# Altium schematic sheet POWER SCH.SchDoc (part 2 of 3)
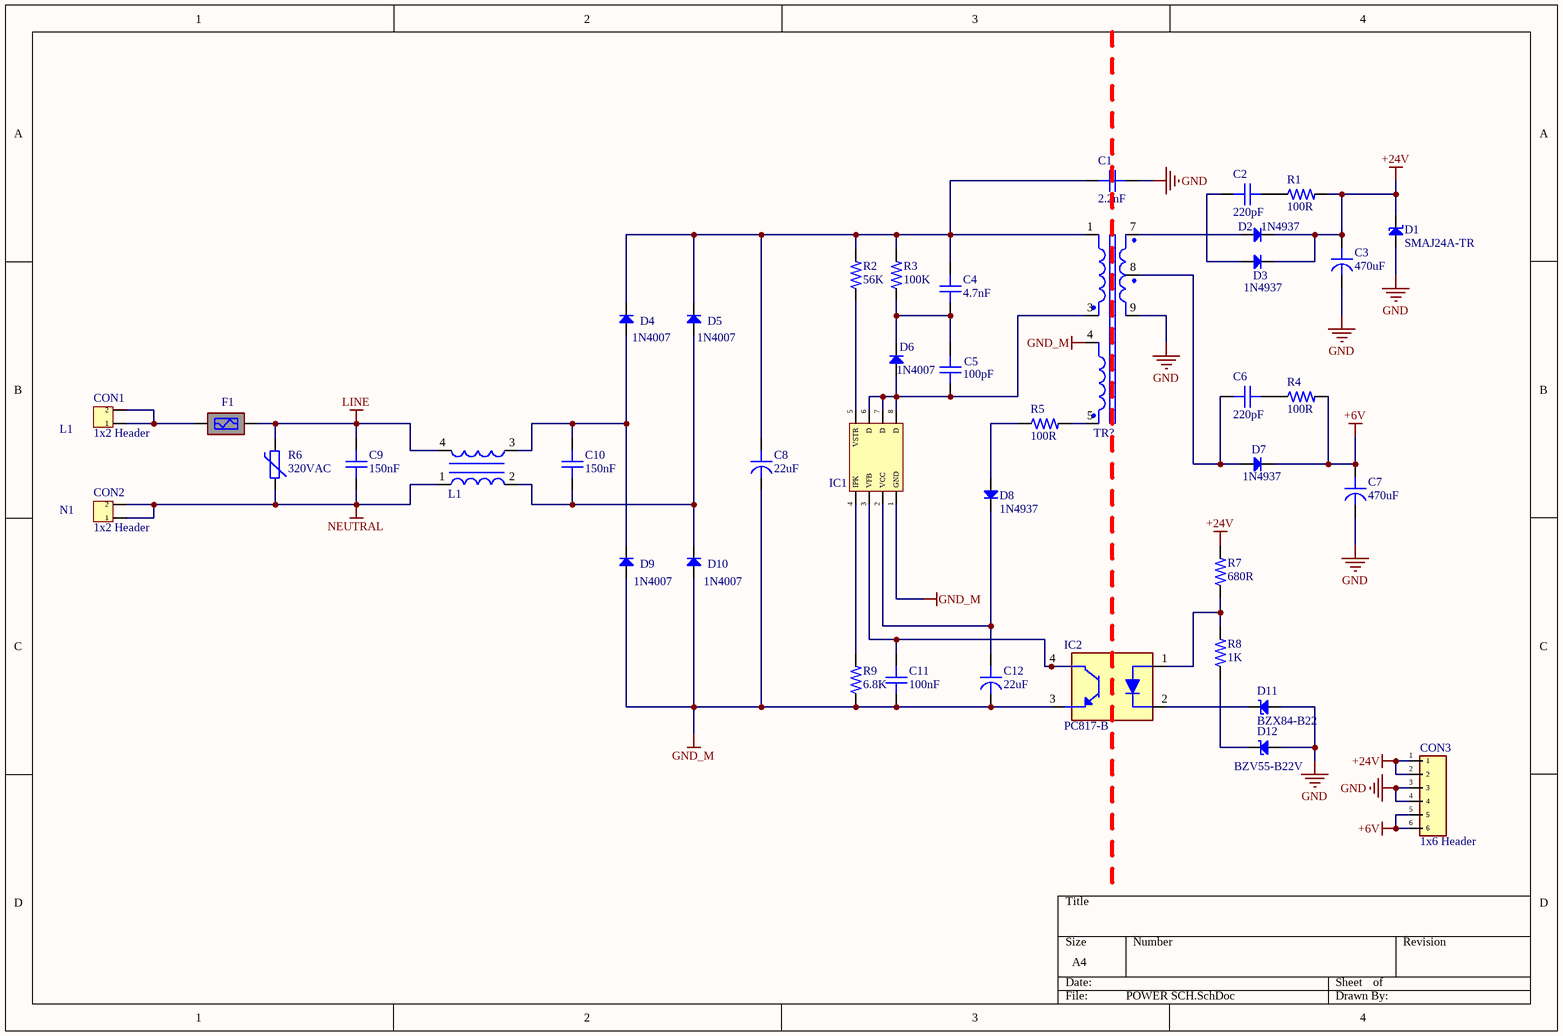
[diagram p1: POWER SCH.SchDoc]
## Library data of the parts
C1 = C0805C222KARACAUTO: KEMET - C0805C222KARACAUTO - KONDENSATOR 2200PF 250V 10% X7R 0805; Component: 1; Dielectric Material: Ceramic; Manufacturer Part Number: C0805C222KARACAUTO; Value: 2.2NF; Supplier 1: Mouser; Supplier Part Number 1: 80-C0805C222KARAUTO; Manufacturer: KEMET; RoHS: Yes; Category: Ceramic Capacitors; Stock 1: 6702; Pricing 1: 1=0,27000, 10=0,11200, 100=0,09400, 500=0,06400, 1000=0,05700, 4000=0,04500 (USD); Mount: Surface Mount; Case/Package: 0805; Min Operating Temperature: -55°C; Max Operating Temperature: 125°C; Capacitance: 2.2nF; Tolerance: 10%; Voltage Rating (DC): 250V; Dielectric: X7R; Length: 2mm; Height: 0.78mm; Depth: 1.2mm; ComponentLink1URL: http://www.farnell.com/datasheets/2571517.pdf?src-supplier=Farnell; ComponentLink1Description: http://www.farnell.com/datasheets/2571517.pdf?src-supplier=Farnell; ComponentLink2URL: https://api.kemet.com/component-edge/download/specsheet/C0805C222KARACAUTO.pdf?src-supplier=Digi-Key; ComponentLink2Description: https://api.kemet.com/component-edge/download/specsheet/C0805C222KARACAUTO.pdf?src-supplier=Digi-Key; ComponentLink3URL: https://api.kemet.com/component-edge/download/datasheet/C0805C222KARACAUTO.pdf?src-supplier=Digi-Key; ComponentLink3Description: https://api.kemet.com/component-edge/download/datasheet/C0805C222KARACAUTO.pdf?src-supplier=Digi-Key; ComponentLink4URL: http://www.farnell.com/datasheets/2571517.pdf?src-supplier=Newark; ComponentLink4Description: http://www.farnell.com/datasheets/2571517.pdf?src-supplier=Newark
C2 C6 = C0805C221KCRACTU: KEMET 220pF Multilayer Ceramic Capacitor (MLCC) 500 V dc 10% X7R dielectric C SMT max op. temp. +125C; Component: 2; Voltage Rating (DC): 500V; Dissipation Factor: 2.5%; Manufacturer Part Number: C0805C221KCRACTU; Value: 220pF; Supplier 1: Mouser; Supplier Part Number 1: 80-C0805C221KCR; Manufacturer: KEMET; RoHS: Yes; Category: Ceramic Capacitors; Stock 1: 17842; Pricing 1: 1=0,37000, 10=0,21600, 100=0,15700, 500=0,13900, 1000=0,11800, 2500=0,09500 (USD); Mount: Surface Mount,PCB; Case/Package: 0805; Dielectric Material: Ceramic; Min Operating Temperature: -55°C; Max Operating Temperature: 125°C; Capacitance: 220pF; Tolerance: 10%; Dielectric: X7R; Length: 2mm; Height: 1.25mm; Depth: 1.2mm; ComponentLink1URL: https://datasheet.ciiva.com/14606/70096142-14606492.pdf?src-supplier=Allied+Electronics; ComponentLink1Description: https://datasheet.ciiva.com/14606/70096142-14606492.pdf?src-supplier=Allied+Electronics; Number of Pins: 2; Case Code (Metric): 2012; Case Code (Imperial): 0805; Packaging: Tape and Reel; Voltage Rating: 500V; Package Quantity: 1; Termination: SMD/SMT; Voltage: 500V; Width: 0.049inch; Thickness: 0.055inch
C3 C7 = ADT-AMP1251106S4BS165A1: Cap Aluminum 470uF 35V 20% (10 X 16mm) Radial 5mm 1790mA 8000 hr 105°C Ammo Pack; Manufacturer: Adam Equipment; Component: 11; Dissipation Factor: 0.12%; Life (Hours): 8000Hour; Ripple Current: 1.79A; ESR (Equivalent Series Resistance): 28mR; Lead Diameter: 0.65mm; Lead Length: 25mm; Insulation Resistance: 10GR; Temperature Coefficient: 350ppm/°C; Manufacturer Part Number: ADT-AMP1251106S4BS165A1; Value: 470uF; Supplier 1: Digi-Key; Supplier Part Number 1: P15391CT-ND; RoHS: No; Category: Aluminum Electrolytic Capacitors; Stock 1: 492; Pricing 1: 1=0,69000, 10=0,50800, 50=0,40620, 100=0,34820 (USD); Mount: Through Hole; Case/Package: Radial; Min Operating Temperature: -40°C; Max Operating Temperature: 105°C; Capacitance: 470uF; Tolerance: 20%; Voltage Rating (DC): 35V; ComponentLink1URL: https://datasheet.ciiva.com/7718/59374-7718894.pdf?src-supplier=Element14; ComponentLink1Description: https://datasheet.ciiva.com/7718/59374-7718894.pdf?src-supplier=Element14; Number of Pins: 2; Packaging: Tape and Reel; Voltage Rating: 35V; Package Quantity: 500; Termination: Radial; Lead Pitch: 5mm; REACH SVHC: No SVHC; Impedance: 28mR
C4 = C0805C472KARACAUTO: KEMET - C0805C472KARACAUTO - Keramikvielschichtkondensator, SMD, 4700 pF, 250 V, 0805 [Metrisch 2012], ± 10%, X7R; Component: 4; Voltage Rating (DC): 250V; Manufacturer Part Number: C0805C472KARACAUTO; Value: 4.7nF; Supplier 1: Mouser; Supplier Part Number 1: 80-C0805C472KARAUTO; Manufacturer: KEMET; RoHS: Yes; Category: Capacitors; Stock 1: 3353; Pricing 1: 1=0,28000, 10=0,11500, 100=0,09700, 500=0,06700, 1000=0,05900, 4000=0,04600 (USD); Case/Package: 0805; Min Operating Temperature: -55°C; Max Operating Temperature: 125°C; Capacitance: 4.7nF; Tolerance: 10%; Dielectric: X7R; Length: 2mm; Height: 1.25mm; ComponentLink1URL: http://www.mouser.com/ds/2/212/KEM_C1023_X7R_AUTO_SMD-1093309.pdf?src-supplier=Mouser; ComponentLink1Description: http://www.mouser.com/ds/2/212/KEM_C1023_X7R_AUTO_SMD-1093309.pdf?src-supplier=Mouser; ComponentLink2URL: http://www.farnell.com/datasheets/2747493.pdf?src-supplier=Farnell; ComponentLink2Description: http://www.farnell.com/datasheets/2747493.pdf?src-supplier=Farnell; ComponentLink3URL: http://www.farnell.com/datasheets/2747493.pdf?src-supplier=Element14; ComponentLink3Description: http://www.farnell.com/datasheets/2747493.pdf?src-supplier=Element14; ComponentLink4URL: https://api.kemet.com/component-edge/download/specsheet/C0805C472KARACAUTO.pdf?src-supplier=Digi-Key; ComponentLink4Description: https://api.kemet.com/component-edge/download/specsheet/C0805C472KARACAUTO.pdf?src-supplier=Digi-Key; Case Code (Metric): 2012; Case Code (Imperial): 0805; Packaging: Tape and Reel; Voltage Rating: 250V; Package Quantity: 4000; Termination: SMD/SMT; Width: 1.2mm; ComponentLink5URL: http://www.farnell.com/datasheets/2747493.pdf?src-supplier=Newark; ComponentLink5Description: http://www.farnell.com/datasheets/2747493.pdf?src-supplier=Newark
C5 = C0805C101KDRACTU: CAP CER 100PF 1KV X7R 0805; Manufacturer: KEMET; Component: 5; Dielectric Material: Ceramic; Tolerance: 10%; Voltage Rating (DC): 1.5kV; Manufacturer Part Number: C0805C101KDRACTU; Value: 100pF; Supplier 1: Mouser; Supplier Part Number 1: 80-C0805C101KDRACTU; RoHS: Yes; Category: Ceramic Capacitors; Stock 1: 2330; Pricing 1: 1=0,52000, 10=0,31300, 100=0,18900, 500=0,16100, 1000=0,13900, 2500=0,10000 (USD); Mount: Surface Mount; Case/Package: 0805; Min Operating Temperature: -55°C; Max Operating Temperature: 125°C; Capacitance: 100pF; Dielectric: X7R; Length: 2mm; Height: 1.25mm; Depth: 1.25mm; ComponentLink1URL: http://www.farnell.com/datasheets/2315402.pdf?src-supplier=Farnell; ComponentLink1Description: http://www.farnell.com/datasheets/2315402.pdf?src-supplier=Farnell; ComponentLink2URL: http://components.arrow.com/part/dataview/0323_00070989?src-supplier=Arrow+Europe; ComponentLink2Description: http://components.arrow.com/part/dataview/0323_00070989?src-supplier=Arrow+Europe; ComponentLink3URL: http://www.mouser.com/ds/2/212/KEM_C1010_X7R_HV_SMD-1102742.pdf?src-supplier=Mouser; ComponentLink3Description: http://www.mouser.com/ds/2/212/KEM_C1010_X7R_HV_SMD-1102742.pdf?src-supplier=Mouser; ComponentLink4URL: https://search.kemet.com/component-edge/download/datasheet/C0805C101KDRACTU.pdf?src-supplier=Digi-Key; ComponentLink4Description: https://search.kemet.com/component-edge/download/datasheet/C0805C101KDRACTU.pdf?src-supplier=Digi-Key; Case Code (Metric): 2012; Case Code (Imperial): 0805; Packaging: Tape and Reel; Voltage Rating: 1kV; Package Quantity: 1; Termination: SMD/SMT; Width: 0.049inch; Thickness: 0.055inch; Radiation Hardening: No; ComponentLink5URL: https://api.kemet.com/component-edge/download/datasheet/C0805C101KDRACTU.pdf?src-supplier=Digi-Key; ComponentLink5Description: https://api.kemet.com/component-edge/download/datasheet/C0805C101KDRACTU.pdf?src-supplier=Digi-Key
C8 = PEG124YH2220QL1: Aluminum Electrolytic Capacitors - Leaded 22uF 450VDC -10% to 30%; Manufacturer: KEMET; Component: 6; Dielectric Material: Aluminium; Voltage Rating (DC): 450V; Ripple Current: 240mA; Leakage Current: 63.4uA; ESR (Equivalent Series Resistance): 2.4R; Lead Diameter: 0.8mm; Lead Length: 42mm; Manufacturer Part Number: PEG124YH2220QL1; Value: 22uF; Supplier 1: Mouser; Supplier Part Number 1: 80-PEG124YH2220QL1; RoHS: Yes; Category: Aluminum Electrolytic Capacitors; Stock 1: 959; Pricing 1: 1=5,43000, 10=4,97000, 50=4,50000, 100=4,13000, 250=3,74000, 500=3,73000 (USD); Mount: Through Hole; Case/Package: Axial; Min Operating Temperature: -40°C; Max Operating Temperature: 125°C; Capacitance: 22uF; Tolerance: 30%; Length: 29mm; ComponentLink1URL: https://www.distrelec.biz/Web/Downloads/at/_e/xwPEG124xxx_dat_e.pdf?mime=application%2Fpdf&src-supplier=Distrelec; ComponentLink1Description: https://www.distrelec.biz/Web/Downloads/at/_e/xwPEG124xxx_dat_e.pdf?mime=application%2Fpdf&src-supplier=Distrelec; ComponentLink2URL: http://components.arrow.com/part/dataview/0323_01891001?src-supplier=Arrow+Europe; ComponentLink2Description: http://components.arrow.com/part/dataview/0323_01891001?src-supplier=Arrow+Europe; ComponentLink3URL: http://www.alliedelec.com/m/d/cbb45dc6290b6e87b76194cff6cccb64.pdf?src-supplier=Allied+Electronics; ComponentLink3Description: http://www.alliedelec.com/m/d/cbb45dc6290b6e87b76194cff6cccb64.pdf?src-supplier=Allied+Electronics; ComponentLink4URL: http://www.mouser.com/ds/2/212/KEM_A4011_PEG124-1104316.pdf?src-supplier=Mouser; ComponentLink4Description: http://www.mouser.com/ds/2/212/KEM_A4011_PEG124-1104316.pdf?src-supplier=Mouser; Packaging: Bulk; Voltage Rating: 450V; Package Quantity: 150; Termination: Axial; Voltage: 450V; Diameter: 20mm; Radiation Hardening: No; ComponentLink5URL: http://uk.rs-online.com/webdocs/00ab/0900766b800abff0.pdf?src-supplier=RSComponents; ComponentLink5Description: http://uk.rs-online.com/webdocs/00ab/0900766b800abff0.pdf?src-supplier=RSComponents; ComponentLink6URL: http://capacitoredge.kemet.com/capedge2/DataSheet?pn=A142ML220Q450A&src-supplier=Avnet; ComponentLink6Description: http://capacitoredge.kemet.com/capedge2/DataSheet?pn=A142ML220Q450A&src-supplier=Avnet; ComponentLink7URL: http://capacitoredge.kemet.com/capedge2/DataSheet?pn=A142ML220Q450A&src-supplier=Avnet+Europe; ComponentLink7Description: http://capacitoredge.kemet.com/capedge2/DataSheet?pn=A142ML220Q450A&src-supplier=Avnet+Europe
C9 C10 = ECQ-UAAF154M: Cap Film 0.15uF 275VAC PP 20% (17.5 X 6 X 13mm) Radial 15mm 110C Bulk; Manufacturer: Panasonic; Component: 7; Voltage: 275V; Lead Diameter: 0.6mm; Lead/Base Style: Straight; Manufacturer Part Number: ECQ-UAAF154M; Value: 0.15uF; Supplier 1: Mouser; Supplier Part Number 1: 667-ECQ-UAAF154M; RoHS: Yes; Category: Film Capacitors; Stock 1: 1407; Pricing 1: 1=0,48000, 10=0,34000, 100=0,22400, 500=0,16600, 1000=0,14100, 2000=0,12400 (USD); Mount: Through Hole; Case/Package: Radial; Dielectric Material: PP; Min Operating Temperature: -40°C; Max Operating Temperature: 110°C; Capacitance: 150nF; Tolerance: 20%; Dielectric: PP; Length: 17.5mm; Height: 13mm; Depth: 6mm; ComponentLink1URL: https://datasheet.ciiva.com/11792/0900766b80fb6a81-11792240.pdf?src-supplier=RSComponents; ComponentLink1Description: https://datasheet.ciiva.com/11792/0900766b80fb6a81-11792240.pdf?src-supplier=RSComponents; ComponentLink2URL: https://datasheet.ciiva.com/46399/1382881-46399669.pdf?src-supplier=Element14; ComponentLink2Description: https://datasheet.ciiva.com/46399/1382881-46399669.pdf?src-supplier=Element14; ComponentLink3URL: https://datasheet.ciiva.com/17632/abd0000ce53-17632333.pdf?src-supplier=Avnet+Europe; ComponentLink3Description: https://datasheet.ciiva.com/17632/abd0000ce53-17632333.pdf?src-supplier=Avnet+Europe; ComponentLink4URL: https://datasheet.ciiva.com/30066/47abd0000ce53-30066232.pdf?src-supplier=Onlinecomponents.com; ComponentLink4Description: https://datasheet.ciiva.com/30066/47abd0000ce53-30066232.pdf?src-supplier=Onlinecomponents.com; Number of Pins: 2; Packaging: Bulk; Package Quantity: 100; Termination: Radial; Width: 0.236inch; Contact Plating: Tin; Height - Seated (Max): 0.531inch; Lead Pitch: 15mm; Radiation Hardening: No; REACH SVHC: No SVHC; Voltage Rating (AC): 275V
C11 = CGA3E2X7R1H104K080AA: TDK - CGA3E2X7R1H104K080AA. - CERAMIC CAPACITOR, 0.1UF, 50V, X7R, 0603, FULL REEL; Component: 8; Tolerance: 10%; Manufacturer Part Number: CGA3E2X7R1H104K080AA; Value: 0.1UF; Supplier 1: Mouser; Supplier Part Number 1: 810-CGA3E2X7R1H104K; Manufacturer: TDK; RoHS: Yes; Category: Ceramic Capacitors; Stock 1: 5553529; Pricing 1: 1=0,11000, 10=0,07900, 100=0,03500, 500=0,02500, 1000=0,01900, 4000=0,01300 (USD); Mount: Surface Mount; Case/Package: 0603; Min Operating Temperature: -55°C; Max Operating Temperature: 125°C; Capacitance: 100nF; Voltage Rating (DC): 50V; Dielectric: X7R; Length: 1.6mm; Height: 0.8mm; Depth: 0.8mm; ComponentLink1URL: https://datasheet.ciiva.com/24216/cga3e2x7r1h104k080aa-266291-24216208.pdf?src-supplier=Mouser; ComponentLink1Description: https://datasheet.ciiva.com/24216/cga3e2x7r1h104k080aa-266291-24216208.pdf?src-supplier=Mouser; ComponentLink2URL: https://datasheet.ciiva.com/15192/getdatasheetpartid-715867-15192412.pdf?src-supplier=Verical; ComponentLink2Description: https://datasheet.ciiva.com/15192/getdatasheetpartid-715867-15192412.pdf?src-supplier=Verical; ComponentLink3URL: https://datasheet.ciiva.com/16500/mlccspec-automotive-general-midvoltage-en-16500693.pdf?src-supplier=Future+Electronics; ComponentLink3Description: https://datasheet.ciiva.com/16500/mlccspec-automotive-general-midvoltage-en-16500693.pdf?src-supplier=Future+Electronics; ComponentLink4URL: https://datasheet.ciiva.com/22725/1735392-22725642.pdf?src-supplier=Element14; ComponentLink4Description: https://datasheet.ciiva.com/22725/1735392-22725642.pdf?src-supplier=Element14; Case Code (Metric): 1608; Case Code (Imperial): 0603; Packaging: Tape and Reel; Voltage Rating: 50V; Package Quantity: 1; Termination: SMD/SMT; Voltage: 50V; Width: 0.8mm; Thickness: 0.035inch; Radiation Hardening: No; REACH SVHC: No SVHC; Lead Free: Lead Free; ComponentLink5URL: https://datasheet.ciiva.com/23803/1936565-23803084.pdf?src-supplier=Newark; ComponentLink5Description: https://datasheet.ciiva.com/23803/1936565-23803084.pdf?src-supplier=Newark; ComponentLink6URL: https://datasheet.ciiva.com/46385/1735392-46385708.pdf?src-supplier=Element14; ComponentLink6Description: https://datasheet.ciiva.com/46385/1735392-46385708.pdf?src-supplier=Element14; Weight: 7.1E-05oz; Composition: Ceramic; Ratings: AEC-Q200
C12 = EEE-1VA220SP: CAP, ALU ELEC, 22UF, 35V, SMD; Manufacturer: Panasonic; Component: 21; Dielectric Material: Aluminium; Tolerance: 20%; Life (Hours): 2000Hour; Ripple Current: 60mA; Leakage Current: 3uA; Lead Length: 2.6mm; Manufacturer Part Number: EEE-1VA220SP; Supplier 1: Digi-Key; Supplier Part Number 1: PCE3952CT-ND; RoHS: Yes; Category: Aluminum Electrolytic Capacitors; Stock 1: 207; Pricing 1: 1=0,33000, 10=0,23000, 50=0,16100, 100=0,13790, 500=0,10346 (USD); Mount: Surface Mount,PCB; Case/Package: Radial; Min Operating Temperature: -40°C; Max Operating Temperature: 85°C; Capacitance: 22uF; Voltage Rating (DC): 35V; Length: 5.5mm; Height: 5.4mm; ComponentLink1URL: https://datasheet.ciiva.com/11778/0900766b8078636e-11778914.pdf?src-supplier=RSComponents; ComponentLink1Description: https://datasheet.ciiva.com/11778/0900766b8078636e-11778914.pdf?src-supplier=RSComponents; ComponentLink2URL: https://datasheet.ciiva.com/15166/getdatasheetpartid-135375-15166031.pdf?src-supplier=Verical; ComponentLink2Description: https://datasheet.ciiva.com/15166/getdatasheetpartid-135375-15166031.pdf?src-supplier=Verical; ComponentLink3URL: https://datasheet.ciiva.com/6085/aba0000ce2-6085109.pdf?src-supplier=Farnell; ComponentLink3Description: https://datasheet.ciiva.com/6085/aba0000ce2-6085109.pdf?src-supplier=Farnell; ComponentLink4URL: https://datasheet.ciiva.com/46376/aba0000ce2-46376415.pdf?src-supplier=Element14; ComponentLink4Description: https://datasheet.ciiva.com/46376/aba0000ce2-46376415.pdf?src-supplier=Element14; Number of Pins: 2; Packaging: Tape and Reel; Voltage Rating: 35V; Package Quantity: 1; Termination: SMD/SMT; Voltage: 35V; Width: 6.6mm; Contact Plating: Tin; Ripple Current (AC): 60mA; Diameter: 6.3mm; Height - Seated (Max): 0.213inch; Lead Pitch: 1.8mm; Radiation Hardening: No; REACH SVHC: No SVHC; Lead Free: Lead Free
CON1 CON2 = OSTOQ025450: TERM BLOCK HDR 2POS VERT 5.08MM; Manufacturer: On-Shore Technology; Component: 7; Number of Positions: 2; Manufacturer Part Number: OSTOQ025450; Supplier 1: Digi-Key; Supplier Part Number 1: ED2843-ND; RoHS: Yes; Category: Terminal Blocks; Stock 1: 6008; Pricing 1: 1=0,51000, 10=0,28000, 25=0,20880, 50=0,18620, 100=0,18250, 250=0,16060, 500=0,14600, 1000=0,13140, 5000=0,09855 (USD); Number of Pins: 2; Min Operating Temperature: -30°C; Max Operating Temperature: 105°C; Packaging: Bulk; Mount: Through Hole; Contact Plating: Tin; Termination: Solder; Color: Green
CON3 = TSW-106-07-L-S: Conn Unshrouded Header HDR 6 POS 2.54mm Solder ST Thru-Hole; Manufacturer: Samtec; Component: 5; Output Current: 125°C; Max Supply Current: 15.24mm; Tolerance: Gold; Voltage Rating: 250V; Current Rating: 2A; Current: 10A; Max DC Current: Bronze; Test Frequency: Black; Max Current Rating: Polyester; Inductance Tolerance: 1; Self Resonant Frequency: 7.6A; Min Supply Voltage: 6; Max Supply Voltage: Vertical; Number of Inputs: Male; Propagation Delay: Male Pin; Number of Elements: 0.23inch; Power Dissipation: 1.6W; Number of Positions: 2; Voltage: 300V; Pitch: 0.15inch; Insertion Loss: 1dB; Shielding: Unshielded; Body Material: Glass; Manufacturer Part Number: TSW-106-07-L-S; Supplier 1: Mouser; Supplier Part Number 1: 200-TSW10607LS; RoHS: Yes; Category: Headers and Wire Housings; Stock 1: 2038; Pricing 1: 1=0,56000, 10=0,41900, 100=0,36700, 500=0,35000, 1000=0,28800, 2500=0,25300 (USD); Min Operating Temperature: -30°C; Max Operating Temperature: -55°C; Package Quantity: 10; Packaging: Bulk; Interface: 2.54mm; Number of Channels: https://datasheet.ciiva.com/22677/82167-22677747.pdf?src-supplier=Element14; Min Dual Supply Voltage: https://datasheet.ciiva.com/22677/82167-22677747.pdf?src-supplier=Element14; Max Output Current: https://datasheet.ciiva.com/23732/320951-23732070.pdf?src-supplier=Newark; REACH SVHC: https://datasheet.ciiva.com/23732/320951-23732070.pdf?src-supplier=Newark; Halogen Free: https://datasheet.ciiva.com/25618/0900766b81154476-25618441.pdf?src-supplier=RSComponents; ComponentLink1URL: https://datasheet.ciiva.com/25618/0900766b81154476-25618441.pdf?src-supplier=RSComponents; ComponentLink1Description: https://datasheet.ciiva.com/16723/htsw-th-16723150.pdf?src-supplier=Avnet+Europe; ComponentLink2URL: https://datasheet.ciiva.com/16723/htsw-th-16723150.pdf?src-supplier=Avnet+Europe; ComponentLink3URL: https://datasheet.ciiva.com/794/ostoqxx3251-794870.pdf?src-supplier=Digi-Key; ComponentLink3Description: https://datasheet.ciiva.com/794/ostoqxx3251-794870.pdf?src-supplier=Digi-Key; ComponentLink4URL: Bulk; ComponentLink4Description: 550V; Mount: 1; Weight: Solder; Contact Plating: Tin; Termination: Solder; Voltage Rating (DC): 250V; Length: No; Height: No SVHC; Width: Lead Free; Depth: https://datasheet.ciiva.com/48561/htsw-th-48561118.pdf?src-supplier=Avnet; Radiation Hardening: https://datasheet.ciiva.com/48561/htsw-th-48561118.pdf?src-supplier=Avnet; Lead Free: https://datasheet.ciiva.com/48560/htsw-th-48560639.pdf?src-supplier=Avnet; ComponentLink5URL: https://datasheet.ciiva.com/48560/htsw-th-48560639.pdf?src-supplier=Avnet; ComponentLink6URL: https://datasheet.ciiva.com/794/ostoqxx5450-794868.pdf?src-supplier=Digi-Key; ComponentLink6Description: https://datasheet.ciiva.com/794/ostoqxx5450-794868.pdf?src-supplier=Digi-Key; ComponentLink7URL: http://www.mouser.com/ds/2/177/5c0054-77730.pdf?src-supplier=Mouser; ComponentLink7Description: http://www.mouser.com/ds/2/177/5c0054-77730.pdf?src-supplier=Mouser; Inductance: Black; Number of Terminals: 550V; Turn-On Delay Time: 6; Number of Circuits: 7.6A; Logic Function: 2.54mm; Color: Green; Number of Positions Per Level: 2; Number of Levels: 1; Orientation: Vertical; Height - Seated (Max): 49.28mm; Supplier 2: Digi-Key; Supplier Part Number 2: HM2523-ND; Stock 2: 1; Housing Material: Glass; Voltage Rating (AC): 250V
D1 = SMAJ24A-TR: STMICROELECTRONICS - SMAJ24A-TR - DIODE, TVS, 24V, 400W, UNI, SMA, RL; Component: 29; Capacitance: 600pF; Leakage Current: 200nA; Direction: Unidirectional; Clamping Voltage: 50V; Min Breakdown Voltage: 26.7V; Test Current: 1mA; Peak Pulse Current: 46A; Element Configuration: Single; Number of Elements: 1; Power Line Protection: No; Max Breakdown Voltage: 28.1V; Max Power Dissipation: 3.3W; ESD Protection: Yes; Manufacturer Part Number: SMAJ24A-TR; Supplier 1: Digi-Key; Supplier Part Number 1: 497-12777-1-ND; Manufacturer: STMicroelectronics; RoHS: Yes; Category: TVS Diodes; Stock 1: 27401; Pricing 1: 1=0,45000, 10=0,34200, 25=0,30840, 100=0,16270, 500=0,14418, 1000=0,11220, 2500=0,10266 (USD); Mount: Surface Mount; Case/Package: SMA; Min Operating Temperature: -55°C; Max Operating Temperature: 150°C; Voltage Rating (DC): 24V; Length: 4.6mm; Height: 2.03mm; ComponentLink1URL: https://datasheet.ciiva.com/15143/getdatasheetpartid-82957-15143307.pdf?src-supplier=Verical; ComponentLink1Description: https://datasheet.ciiva.com/15143/getdatasheetpartid-82957-15143307.pdf?src-supplier=Verical; ComponentLink2URL: https://datasheet.ciiva.com/7965/1724007-7965493.pdf?src-supplier=Element14; ComponentLink2Description: https://datasheet.ciiva.com/7965/1724007-7965493.pdf?src-supplier=Element14; ComponentLink3URL: https://datasheet.ciiva.com/16204/cd00001333-16204855.pdf?src-supplier=Future+Electronics; ComponentLink3Description: https://datasheet.ciiva.com/16204/cd00001333-16204855.pdf?src-supplier=Future+Electronics; ComponentLink4URL: https://datasheet.ciiva.com/46394/1724007-46394359.pdf?src-supplier=Element14; ComponentLink4Description: https://datasheet.ciiva.com/46394/1724007-46394359.pdf?src-supplier=Element14; Number of Pins: 2; Packaging: Tape and Reel; Package Quantity: 1; Termination: SMD/SMT; Composition: Zener; Lead Free: Lead Free; REACH SVHC: No SVHC; Width: 2.95mm; Radiation Hardening: No; ComponentLink5URL: https://datasheet.ciiva.com/337/cd00001333-337721.pdf?src-supplier=Digi-Key; ComponentLink5Description: https://datasheet.ciiva.com/337/cd00001333-337721.pdf?src-supplier=Digi-Key; ComponentLink6URL: https://datasheet.ciiva.com/337/cd00001333-337722.pdf?src-supplier=Digi-Key; ComponentLink6Description: https://datasheet.ciiva.com/337/cd00001333-337722.pdf?src-supplier=Digi-Key; ComponentLink7URL: https://datasheet.ciiva.com/337/cd00001333-337723.pdf?src-supplier=Digi-Key; ComponentLink7Description: https://datasheet.ciiva.com/337/cd00001333-337723.pdf?src-supplier=Digi-Key; Peak Pulse Power: 400W; Reverse Standoff Voltage: 24V; Max Reverse Leakage Current: 200nA; Reverse Breakdown Voltage: 26.7V; Operating Supply Voltage: 24V; Max Surge Current: 1mA; Breakdown Voltage: 26.7V; Number of Unidirectional Channels: 1; Power Dissipation: 400W; Polarity: Unidirectional; ComponentLink8URL: https://datasheet.ciiva.com/41443/001183973-da-01-en-transil-400w-24v-smaj24a-tr-do-214ac-stm-41443285.pdf?src-supplier=Conrad; ComponentLink8Description: https://datasheet.ciiva.com/41443/001183973-da-01-en-transil-400w-24v-smaj24a-tr-do-214ac-stm-41443285.pdf?src-supplier=Conrad
D2 D3 D7 D8 = STTH1L06A: DIODE GEN PURP 600V 1A SMA; Manufacturer: STMicroelectronics; Component: 25; Element Configuration: Single; Max Surge Current: 20A; Reverse Recovery Time: 80ns; Peak Reverse Current: 1uA; Forward Voltage: 1.3V; Max Forward Surge Current (Ifsm): 10A; Polarity: Standard; Manufacturer Part Number: STTH1L06A; Supplier 1: Digi-Key; Supplier Part Number 1: 497-3241-1-ND; RoHS: Yes; Category: Rectifier Diodes; Stock 1: 40096; Pricing 1: 1=0,38000, 10=0,30600, 25=0,27960, 100=0,17550, 500=0,16250, 1000=0,11050, 2500=0,10595 (USD); Mount: Surface Mount; Case/Package: SMA; Min Operating Temperature: -65°C; Max Operating Temperature: 175°C; Voltage Rating (DC): 600V; Length: 4.6mm; Height: 2.03mm; ComponentLink1URL: https://datasheet.ciiva.com/915/cd00002694-915858.pdf?src-supplier=Digi-Key; ComponentLink1Description: https://datasheet.ciiva.com/915/cd00002694-915858.pdf?src-supplier=Digi-Key; ComponentLink2URL: https://datasheet.ciiva.com/915/cd00002694-915859.pdf?src-supplier=Digi-Key; ComponentLink2Description: https://datasheet.ciiva.com/915/cd00002694-915859.pdf?src-supplier=Digi-Key; ComponentLink3URL: https://datasheet.ciiva.com/915/cd00002694-915860.pdf?src-supplier=Digi-Key; ComponentLink3Description: https://datasheet.ciiva.com/915/cd00002694-915860.pdf?src-supplier=Digi-Key; ComponentLink4URL: https://datasheet.ciiva.com/26818/getdatasheetpartid-65243-26818021.pdf?src-supplier=Verical; ComponentLink4Description: https://datasheet.ciiva.com/26818/getdatasheetpartid-65243-26818021.pdf?src-supplier=Verical; Number of Pins: 2; Contact Plating: Tin,Matte; Packaging: Tape and Reel; Package Quantity: 1; Lead Free: Lead Free; REACH SVHC: No SVHC; Width: 2.95mm; Radiation Hardening: No; ComponentLink5URL: https://datasheet.ciiva.com/25949/cd00002694-25949159.pdf?src-supplier=Avnet+Europe; ComponentLink5Description: https://datasheet.ciiva.com/25949/cd00002694-25949159.pdf?src-supplier=Avnet+Europe; ComponentLink6URL: https://datasheet.ciiva.com/7964/1671053-7964013.pdf?src-supplier=Element14; ComponentLink6Description: https://datasheet.ciiva.com/7964/1671053-7964013.pdf?src-supplier=Element14; ComponentLink7URL: https://datasheet.ciiva.com/7964/1671053-7964014.pdf?src-supplier=Element14; ComponentLink7Description: https://datasheet.ciiva.com/7964/1671053-7964014.pdf?src-supplier=Element14; Current Rating: 1A; Peak Non-Repetitive Surge Current: 20A; Max Repetitive Reverse Voltage (Vrrm): 600V; Recovery Time: 80ns; Average Rectified Current: 1A; Max Reverse Voltage (DC): 600V; Reverse Voltage: 600V; Forward Current: 1A; Output Current: 1A; Supplier 2: Digi-Key; Supplier Part Number 2: MMSZ5251BT1GOSCT-ND
D4-D6 = RS1M-13-F: Diode Switching 1KV 1A 2-Pin SMA T/R; Manufacturer: Diodes; Component: 30; Capacitance: 15pF; Element Configuration: Single; Max Surge Current: 30A; Reverse Recovery Time: 500ns; Peak Reverse Current: 5uA; Forward Voltage: 1.3V; Polarity: Standard; Manufacturer Part Number: RS1M-13-F; Supplier 1: Digi-Key; Supplier Part Number 1: RS1M-FDICT-ND; RoHS: Yes; Category: Rectifier Diodes; Stock 1: 175534; Pricing 1: 1=0,45000, 10=0,33900, 25=0,30560, 100=0,16110, 500=0,14276, 1000=0,11110, 2500=0,10166 (USD); Mount: Surface Mount; Case/Package: SMA; Min Operating Temperature: -65°C; Max Operating Temperature: 150°C; Voltage Rating (DC): 1kV; Length: 4.6mm; Height: 2.1mm; ComponentLink1URL: https://datasheet.ciiva.com/22695/1911854-22695829.pdf?src-supplier=Element14; ComponentLink1Description: https://datasheet.ciiva.com/22695/1911854-22695829.pdf?src-supplier=Element14; ComponentLink2URL: https://datasheet.ciiva.com/8301/ds15002-8301719.pdf?src-supplier=Avnet; ComponentLink2Description: https://datasheet.ciiva.com/8301/ds15002-8301719.pdf?src-supplier=Avnet; ComponentLink3URL: https://datasheet.ciiva.com/15144/getdatasheetpartid-102368-15144828.pdf?src-supplier=Verical; ComponentLink3Description: https://datasheet.ciiva.com/15144/getdatasheetpartid-102368-15144828.pdf?src-supplier=Verical; ComponentLink4URL: https://datasheet.ciiva.com/25946/ds15002-25946237.pdf?src-supplier=Avnet+Europe; ComponentLink4Description: https://datasheet.ciiva.com/25946/ds15002-25946237.pdf?src-supplier=Avnet+Europe; Number of Pins: 2; Packaging: Tape and Reel; Package Quantity: 5000; Lead Free: Lead Free; REACH SVHC: No SVHC; Width: 2.92mm; Radiation Hardening: No; Voltage: 1kV; Weight: 0.002258oz; Current Rating: 1A; Peak Non-Repetitive Surge Current: 30A; Max Repetitive Reverse Voltage (Vrrm): 1kV; Recovery Time: 500ns; Average Rectified Current: 1A; Max Reverse Voltage (DC): 1kV; Forward Current: 1A; Max Forward Surge Current (Ifsm): 30A; Output Current: 1A; Current: 1A; Reverse Voltage (DC): 1kV
D9 D10 = RS1M-13-F: Manufacturer: Diodes; Component: 30; Capacitance: 15pF; Voltage Rating (DC): 1kV; Current Rating: 1A; Element Configuration: Single; Max Surge Current: 30A; Reverse Recovery Time: 500ns; Peak Reverse Current: 5uA; Forward Voltage: 1.3V; Polarity: Standard; Manufacturer Part Number: RS1M-13-F; Supplier 1: Digi-Key; Supplier Part Number 1: RS1M-FDICT-ND; RoHS: Yes; Category: Rectifier Diodes; Stock 1: 175534; Pricing 1: 1=0,45000, 10=0,33900, 25=0,30560, 100=0,16110, 500=0,14276, 1000=0,11110, 2500=0,10166 (USD); Mount: Surface Mount; Case/Package: SMA; Min Operating Temperature: -65°C; Max Operating Temperature: 150°C; Length: 4.6mm; Height: 2.1mm; ComponentLink1URL: https://datasheet.ciiva.com/22695/1911854-22695829.pdf?src-supplier=Element14; ComponentLink1Description: https://datasheet.ciiva.com/22695/1911854-22695829.pdf?src-supplier=Element14; ComponentLink2URL: https://datasheet.ciiva.com/8301/ds15002-8301719.pdf?src-supplier=Avnet; ComponentLink2Description: https://datasheet.ciiva.com/8301/ds15002-8301719.pdf?src-supplier=Avnet; ComponentLink3URL: https://datasheet.ciiva.com/15144/getdatasheetpartid-102368-15144828.pdf?src-supplier=Verical; ComponentLink3Description: https://datasheet.ciiva.com/15144/getdatasheetpartid-102368-15144828.pdf?src-supplier=Verical; ComponentLink4URL: https://datasheet.ciiva.com/25946/ds15002-25946237.pdf?src-supplier=Avnet+Europe; ComponentLink4Description: https://datasheet.ciiva.com/25946/ds15002-25946237.pdf?src-supplier=Avnet+Europe; Number of Pins: 2; Packaging: Tape and Reel; Package Quantity: 5000; Lead Free: Lead Free; REACH SVHC: No SVHC; Width: 2.92mm; Radiation Hardening: No; Voltage: 1kV; Weight: 0.002258oz; Peak Non-Repetitive Surge Current: 30A; Max Repetitive Reverse Voltage (Vrrm): 1kV; Recovery Time: 500ns; Average Rectified Current: 1A; Max Reverse Voltage (DC): 1kV; Forward Current: 1A; Max Forward Surge Current (Ifsm): 30A; Output Current: 1A; Current: 1A; Reverse Voltage (DC): 1kV
D11 = BZX84C22LT1G: DIODE ZENER 22V 225MW SOT23-3; Manufacturer: ON Semiconductor; Component: 27; Tolerance: 6%; Max Reverse Leakage Current: 50nA; Test Current: 5mA; Element Configuration: Single; Power Dissipation: 300mW; ESD Protection: Yes; Forward Voltage: 900mV; Forward Current: 10mA; Impedance: 55R; Manufacturer Part Number: BZX84C22LT1G; Supplier 1: Digi-Key; Supplier Part Number 1: BZX84C22LT1GOSCT-ND; RoHS: Yes; Category: Zener Diodes; Stock 1: 46073; Pricing 1: 1=0,14000, 10=0,12300, 25=0,11760, 100=0,05170, 500=0,04060, 1000=0,02820 (USD); Case/Package: SOT-23-3; Min Operating Temperature: -65°C; Max Operating Temperature: 150°C; Voltage Rating (DC): 22V; Length: 3.04mm; Height: 1.01mm; ComponentLink1URL: https://datasheet.ciiva.com/30478/0900766b8121b438-30478464.pdf?src-supplier=RSComponents; ComponentLink1Description: https://datasheet.ciiva.com/30478/0900766b8121b438-30478464.pdf?src-supplier=RSComponents; ComponentLink2URL: https://datasheet.ciiva.com/15142/getdatasheetpartid-53776-15142130.pdf?src-supplier=Verical; ComponentLink2Description: https://datasheet.ciiva.com/15142/getdatasheetpartid-53776-15142130.pdf?src-supplier=Verical; ComponentLink3URL: https://datasheet.ciiva.com/894/bzx84c2v4lt1-d-894848.pdf?src-supplier=Digi-Key; ComponentLink3Description: https://datasheet.ciiva.com/894/bzx84c2v4lt1-d-894848.pdf?src-supplier=Digi-Key; ComponentLink4URL: https://datasheet.ciiva.com/894/bzx84c2v4lt1-d-894849.pdf?src-supplier=Digi-Key; ComponentLink4Description: https://datasheet.ciiva.com/894/bzx84c2v4lt1-d-894849.pdf?src-supplier=Digi-Key; Number of Pins: 3; Contact Plating: Tin,Matte; Packaging: Tape and Reel; Package Quantity: 3000; Lead Free: Lead Free; REACH SVHC: No SVHC; Width: 1.4mm; Radiation Hardening: No; ComponentLink5URL: https://datasheet.ciiva.com/894/bzx84c2v4lt1-d-894850.pdf?src-supplier=Digi-Key; ComponentLink5Description: https://datasheet.ciiva.com/894/bzx84c2v4lt1-d-894850.pdf?src-supplier=Digi-Key; ComponentLink6URL: https://datasheet.ciiva.com/25928/bzx84c2v4lt1-d-25928650.pdf?src-supplier=Avnet+Europe; ComponentLink6Description: https://datasheet.ciiva.com/25928/bzx84c2v4lt1-d-25928650.pdf?src-supplier=Avnet+Europe; ComponentLink7URL: https://datasheet.ciiva.com/10637/bzx84c2v4lt1-d-10637787.pdf?src-supplier=Avnet; ComponentLink7Description: https://datasheet.ciiva.com/10637/bzx84c2v4lt1-d-10637787.pdf?src-supplier=Avnet; Max Power Dissipation: 225mW; Peak Reverse Current: 50nA; Halogen Free: Halogen Free; Zener Voltage: 22V; Voltage Tolerance: 6%; Zener Current: 10mA; Power Rating: 225mW; Working Voltage: 22V
D12 = MMSZ22T1G: Zener Diodes 22V 500mW; Manufacturer: ON Semiconductor; Component: 28; Tolerance: 5%; Max Reverse Leakage Current: 50nA; Test Current: 5mA; Element Configuration: Single; Forward Voltage: 900mV; Impedance: 55R; Zener Current: 10mA; Manufacturer Part Number: MMSZ22T1G; Supplier 1: Digi-Key; Supplier Part Number 1: MMSZ22T1GOSCT-ND; RoHS: Yes; Category: Zener Diodes; Stock 1: 35139; Pricing 1: 1=0,21000, 10=0,19300, 25=0,18360, 100=0,08090, 500=0,06350, 1000=0,04410 (USD); Case/Package: SOD-123-2; Min Operating Temperature: -55°C; Max Operating Temperature: 150°C; Voltage Rating (DC): 22V; Length: 2.84mm; Height: 1.25mm; ComponentLink1URL: https://datasheet.ciiva.com/25926/mmsz2v4t1-d-25926218.pdf?src-supplier=Avnet+Europe; ComponentLink1Description: https://datasheet.ciiva.com/25926/mmsz2v4t1-d-25926218.pdf?src-supplier=Avnet+Europe; ComponentLink2URL: https://datasheet.ciiva.com/6388/mmsz2v4t1-d-6388831.pdf?src-supplier=Digi-Key; ComponentLink2Description: https://datasheet.ciiva.com/6388/mmsz2v4t1-d-6388831.pdf?src-supplier=Digi-Key; Number of Pins: 2; Packaging: Tape and Reel; Package Quantity: 3000; Lead Free: Lead Free; Width: 1.8mm; Radiation Hardening: No; Power Dissipation: 500mW; Max Power Dissipation: 500mW; Peak Reverse Current: 50nA; Zener Voltage: 22V; Voltage Tolerance: 5%; Power Rating: 500mW; Working Voltage: 22V
F1 = 0034.3120: SCHURTER - 0034.3120 - Fuse, Cartridge, Time Delay, 2 A, 250 V, 5mm x 20mm, 0.2" x 0.79", FST Series; Component: 9; Manufacturer Part Number: 0034.3120; Supplier 1: Digi-Key; Supplier Part Number 1: 486-1219-ND; Manufacturer: Schurter; RoHS: Yes; Category: Fuses; Stock 1: 9179; Pricing 1: 1=0,44000, 50=0,36400, 100=0,27800, 500=0,21300, 1000=0,19440 (USD); Number of Pins: 2; Mount: Holder,Surface Mount,Clip; Weight: 0.033158oz
IC1 = TLE8102SG: IC SWITCH LOSIDE 2CH DSO-12; Manufacturer: Infineon; Component: 1; Output Current: 5A; Number of Outputs: 2; Nominal Supply Current: 5mA; On-State Resistance: 180mR; Interface: Serial; Min Dual Supply Voltage: 48V; Max Output Current: 6.5A; Manufacturer Part Number: TLE8102SG; Supplier 1: Mouser; Supplier Part Number 1: 726-TLE8102SG; RoHS: Yes; Category: Hot Swap Controllers; Stock 1: 4211; Pricing 1: 1=5,69000, 10=4,84000, 100=4,19000, 250=3,98000, 500=3,57000, 1000=3,01000 (USD); Case/Package: SOIC; Number of Pins: 12; Min Operating Temperature: -40°C; Max Operating Temperature: 150°C; Package Quantity: 1; Packaging: Tape and Reel; Max Supply Current: 5mA; Number of Channels: 2; REACH SVHC: No SVHC; Halogen Free: Halogen Free; ComponentLink1URL: https://datasheet.ciiva.com/41458/001183484-da-01-en-ic-switch-loside-2c-tle8102sg-dso-12-inf-41458732.pdf?src-supplier=Conrad; ComponentLink1Description: https://datasheet.ciiva.com/41458/001183484-da-01-en-ic-switch-loside-2c-tle8102sg-dso-12-inf-41458732.pdf?src-supplier=Conrad; ComponentLink2URL: https://datasheet.ciiva.com/1955/infineon-tle8102sg-ds-v01-05-en-1955985.pdf?src-supplier=Digi-Key; ComponentLink2Description: https://datasheet.ciiva.com/1955/infineon-tle8102sg-ds-v01-05-en-1955985.pdf?src-supplier=Digi-Key; ComponentLink3URL: https://datasheet.ciiva.com/1955/infineon-tle8102sg-ds-v01-05-en-1955986.pdf?src-supplier=Digi-Key; ComponentLink3Description: https://datasheet.ciiva.com/1955/infineon-tle8102sg-ds-v01-05-en-1955986.pdf?src-supplier=Digi-Key; ComponentLink4URL: https://datasheet.ciiva.com/1955/infineon-tle8102sg-ds-v01-05-en-1955987.pdf?src-supplier=Digi-Key; ComponentLink4Description: https://datasheet.ciiva.com/1955/infineon-tle8102sg-ds-v01-05-en-1955987.pdf?src-supplier=Digi-Key
IC2 = NC7WZ132K8X: IC,NC7WZ132K8X,; Manufacturer: ON Semiconductor / Fairchild; Component: 4; Output Current: 32mA; Number of Outputs: 1; Min Supply Voltage: 1.65V; Max Supply Voltage: 5.5V; Number of Inputs: 2; Turn-On Delay Time: 6.3ns; Propagation Delay: 13ns; Logic Function: NAND; Quiescent Current: 1uA; High Level Output Current: -32mA; Schmitt Trigger Input: No; Manufacturer Part Number: NC7WZ132K8X; Supplier 1: Mouser; Supplier Part Number 1: 512-NC7WZ132K8X; RoHS: Yes; Category: Logic Gates; Stock 1: 3369; Pricing 1: 1=0,46000, 10=0,33900, 100=0,18900, 1000=0,14200, 3000=0,12200, 9000=0,11400 (USD); Number of Pins: 8; Min Operating Temperature: -40°C; Max Operating Temperature: 85°C; Package Quantity: 3000; Packaging: Tape and Reel; REACH SVHC: No SVHC; ComponentLink1URL: https://datasheet.ciiva.com/4818/nc7wz132-97672-4818801.pdf?src-supplier=Mouser; ComponentLink1Description: https://datasheet.ciiva.com/4818/nc7wz132-97672-4818801.pdf?src-supplier=Mouser; ComponentLink2URL: https://datasheet.ciiva.com/8278/nc7wz132-8278945.pdf?src-supplier=Avnet; ComponentLink2Description: https://datasheet.ciiva.com/8278/nc7wz132-8278945.pdf?src-supplier=Avnet; ComponentLink3URL: https://datasheet.ciiva.com/15090/getdatasheetpartid-110777-15090731.pdf?src-supplier=Verical; ComponentLink3Description: https://datasheet.ciiva.com/15090/getdatasheetpartid-110777-15090731.pdf?src-supplier=Verical; ComponentLink4URL: https://datasheet.ciiva.com/34301/1027871-34301887.pdf?src-supplier=Jameco; ComponentLink4Description: https://datasheet.ciiva.com/34301/1027871-34301887.pdf?src-supplier=Jameco; Mount: Surface Mount; Weight: 0.03g; Contact Plating: Tin,Matte; Length: 2.3mm; Height: 0.7mm; Width: 2mm; Radiation Hardening: No; Lead Free: Lead Free; ComponentLink5URL: https://datasheet.ciiva.com/26865/nc7wz132k8x-26865071.pdf?src-supplier=IIIC; ComponentLink5Description: https://datasheet.ciiva.com/26865/nc7wz132k8x-26865071.pdf?src-supplier=IIIC; ComponentLink6URL: https://datasheet.ciiva.com/1868/nc7wz132-1868154.pdf?src-supplier=Digi-Key; ComponentLink6Description: https://datasheet.ciiva.com/1868/nc7wz132-1868154.pdf?src-supplier=Digi-Key; ComponentLink7URL: https://datasheet.ciiva.com/1868/nc7wz132-1868155.pdf?src-supplier=Digi-Key; ComponentLink7Description: https://datasheet.ciiva.com/1868/nc7wz132-1868155.pdf?src-supplier=Digi-Key; ComponentLink8URL: https://datasheet.ciiva.com/1868/nc7wz132-1868156.pdf?src-supplier=Digi-Key; ComponentLink8Description: https://datasheet.ciiva.com/1868/nc7wz132-1868156.pdf?src-supplier=Digi-Key; Number of Terminals: 8; Number of Circuits: 2; Number of Elements: 2; Low Level Output Current: 32mA; Number of Gates: 2
L1 = 744272392: WURTH ELEKTRONIK - 744272392 - Filter, Netzfilter, Oberflächenmontage, 2X3900µH, WE-SL5, 9.6 kOhm, 520mA, 10mm x 8.7mm x 6.5mm; Manufacturer: Wurth Electronics; Component: 3; Resistance: 540mR; Tolerance: 40%; Voltage Rating: 80V; Core Material: Ferrite; Impedance: 9.6kR; Number of Lines: 2; Test Frequency: 100kHz; Inductance: 3.9mH; Manufacturer Part Number: 744272392; Value: 2X3900µH; Supplier 1: Mouser; Supplier Part Number 1: 710-744272392; RoHS: Yes; Category: Common Mode Chokes; Stock 1: 1253; Pricing 1: 1=3,14000, 10=2,91000, 25=2,91000, 50=2,63000, 100=2,54000, 250=2,54000 (USD); Case/Package: SMD/SMT; Number of Pins: 4; Min Operating Temperature: -40°C; Max Operating Temperature: 125°C; Package Quantity: 1; Packaging: Tape and Reel; REACH SVHC: No SVHC; ComponentLink1URL: https://datasheet.ciiva.com/7764/1735670-7764962.pdf?src-supplier=Element14; ComponentLink1Description: https://datasheet.ciiva.com/7764/1735670-7764962.pdf?src-supplier=Element14; ComponentLink2URL: https://datasheet.ciiva.com/7265/744272392-7265012.pdf?src-supplier=Newark; ComponentLink2Description: https://datasheet.ciiva.com/7265/744272392-7265012.pdf?src-supplier=Newark; ComponentLink3URL: https://datasheet.ciiva.com/6048/1696178-6048502.pdf?src-supplier=Farnell; ComponentLink3Description: https://datasheet.ciiva.com/6048/1696178-6048502.pdf?src-supplier=Farnell; ComponentLink4URL: https://datasheet.ciiva.com/17069/0900766b80596bb6-17069704.pdf?src-supplier=Allied+Electronics; ComponentLink4Description: https://datasheet.ciiva.com/17069/0900766b80596bb6-17069704.pdf?src-supplier=Allied+Electronics; Mount: Surface Mount; Weight: 0.026103oz; Termination: SMD/SMT; Voltage Rating (DC): 80V; Length: 0.394inch; Height: 6.5mm; Width: 0.343inch; Depth: 8.7mm; Lead Free: Lead Free; ComponentLink5URL: https://datasheet.ciiva.com/4952/744272392-25143-4952443.pdf?src-supplier=Mouser; ComponentLink5Description: https://datasheet.ciiva.com/4952/744272392-25143-4952443.pdf?src-supplier=Mouser; ComponentLink6URL: https://datasheet.ciiva.com/6216/744272392-6216197.pdf?src-supplier=Digi-Key; ComponentLink6Description: https://datasheet.ciiva.com/6216/744272392-6216197.pdf?src-supplier=Digi-Key; ComponentLink7URL: https://datasheet.ciiva.com/6216/744272392-6216199.pdf?src-supplier=Digi-Key; ComponentLink7Description: https://datasheet.ciiva.com/6216/744272392-6216199.pdf?src-supplier=Digi-Key; ComponentLink8URL: https://datasheet.ciiva.com/26308/744272392-eng-tds-26308748.pdf?src-supplier=Distrelec; ComponentLink8Description: https://datasheet.ciiva.com/26308/744272392-eng-tds-26308748.pdf?src-supplier=Distrelec; Current Rating: 520mA; Current: 520mA; DC Resistance (DCR): 540mR; Max DC Current: 520mA; Max Current Rating: 520mA; Inductance Tolerance: 40%; Self Resonant Frequency: 100kHz
R1 R4 R5 = CRCW1206100RJNEA (2): Res Thick Film 1206 100 Ohm 5% 1/4W 200ppm/C Molded SMD SMD Paper T/R; Manufacturer: Vishay Dale; Component: 10; Temperature Coefficient: 200ppm/°C; Power Rating: 250mW; Voltage Rating: 200V; Manufacturer Part Number: CRCW1206100RJNEA (2); Supplier 1: Digi-Key; Supplier Part Number 1: 541-100ECT-ND; RoHS: Yes; Category: Chip SMD Resistors; Stock 1: 1332; Pricing 1: 1=0,10000, 10=0,07000, 100=0,02840, 1000=0,01275, 2500=0,01106 (USD); Mount: Surface Mount; Case/Package: 1206; Weight: 0.000353oz; Case Code (Imperial): 1206; Case Code (Metric): 3216; Contact Plating: Tin; Min Operating Temperature: -55°C; Max Operating Temperature: 155°C; Resistance: 100R; Tolerance: 5%; Packaging: Tape and Reel; Composition: Thick Film; Termination: SMD/SMT; Package Quantity: 5000; Military Standard: Not; Length: 3.2mm; Height: 0.55mm; Width: 1.6mm; Depth: 1.6mm; Radiation Hardening: No; REACH SVHC: Unknown; ComponentLink1URL: https://datasheet.ciiva.com/16755/70201119-16755637.pdf?src-supplier=Allied+Electronics; ComponentLink1Description: https://datasheet.ciiva.com/16755/70201119-16755637.pdf?src-supplier=Allied+Electronics; ComponentLink2URL: https://datasheet.ciiva.com/5547/dcrcwe3-109170-5547382.pdf?src-supplier=Mouser; ComponentLink2Description: https://datasheet.ciiva.com/5547/dcrcwe3-109170-5547382.pdf?src-supplier=Mouser; ComponentLink3URL: https://datasheet.ciiva.com/8979/dcrcwe3-8979850.pdf?src-supplier=Avnet; ComponentLink3Description: https://datasheet.ciiva.com/8979/dcrcwe3-8979850.pdf?src-supplier=Avnet; ComponentLink4URL: https://datasheet.ciiva.com/28621/1847332-28621482.pdf?src-supplier=Element14; ComponentLink4Description: https://datasheet.ciiva.com/28621/1847332-28621482.pdf?src-supplier=Element14; ComponentLink5URL: https://datasheet.ciiva.com/8979/dcrcwe3-8979852.pdf?src-supplier=Avnet; ComponentLink5Description: https://datasheet.ciiva.com/8979/dcrcwe3-8979852.pdf?src-supplier=Avnet; ComponentLink6URL: https://datasheet.ciiva.com/16759/70201119-16759884.pdf?src-supplier=Allied+Electronics; ComponentLink6Description: https://datasheet.ciiva.com/16759/70201119-16759884.pdf?src-supplier=Allied+Electronics; ComponentLink7URL: https://datasheet.ciiva.com/17171/dcrcwe3-17171503.pdf?src-supplier=Avnet+Europe; ComponentLink7Description: https://datasheet.ciiva.com/17171/dcrcwe3-17171503.pdf?src-supplier=Avnet+Europe
R2 = CRCW120656K0JNEA: Resistor,Metal Glaze,56KOhms,200WV,5+/-% Tol,-200,200ppm-TC,1206-Case ;RoHS Compliant: Yes; Manufacturer: Vishay Dale; Component: 11; Resistance: 56kR; Tolerance: 5%; Temperature Coefficient: 200ppm/°C; Max Power Dissipation: 250mW; Voltage Rating: 200V; Manufacturer Part Number: CRCW120656K0JNEA; Supplier 1: Digi-Key; Supplier Part Number 1: 541-56KECT-ND; RoHS: Yes; Category: Chip SMD Resistors; Stock 1: 3044; Pricing 1: 1=0,10000, 10=0,07000, 100=0,02840, 1000=0,01275, 2500=0,01106 (USD); Case/Package: 1206; Number of Pins: 2; Weight: 0.000353oz; Case Code (Imperial): 1206; Case Code (Metric): 3216; Contact Plating: Tin; Min Operating Temperature: -55°C; Max Operating Temperature: 155°C; Packaging: Tape and Reel; Composition: Thick Film; Number of Terminations: 2; Features: Automotive AEC-Q200; Power Rating: 250mW; Package Quantity: 5000; Voltage Rating (DC): 200V; Military Standard: Not; Length: 3.2mm; Height: 0.55mm; Width: 0.063inch; Depth: 1.6mm; Radiation Hardening: No; Lead Free: Lead Free; REACH SVHC: Unknown; ComponentLink1URL: https://datasheet.ciiva.com/2496/dcrcwe3-2496448.pdf?src-supplier=Digi-Key; ComponentLink1Description: https://datasheet.ciiva.com/2496/dcrcwe3-2496448.pdf?src-supplier=Digi-Key; ComponentLink2URL: https://datasheet.ciiva.com/2496/dcrcwe3-2496449.pdf?src-supplier=Digi-Key; ComponentLink2Description: https://datasheet.ciiva.com/2496/dcrcwe3-2496449.pdf?src-supplier=Digi-Key; ComponentLink3URL: https://datasheet.ciiva.com/2496/dcrcwe3-2496450.pdf?src-supplier=Digi-Key; ComponentLink3Description: https://datasheet.ciiva.com/2496/dcrcwe3-2496450.pdf?src-supplier=Digi-Key; ComponentLink4URL: https://datasheet.ciiva.com/8999/dcrcwe3-8999045.pdf?src-supplier=Avnet; ComponentLink4Description: https://datasheet.ciiva.com/8999/dcrcwe3-8999045.pdf?src-supplier=Avnet; ComponentLink5URL: https://datasheet.ciiva.com/8999/dcrcwe3-8999051.pdf?src-supplier=Avnet; ComponentLink5Description: https://datasheet.ciiva.com/8999/dcrcwe3-8999051.pdf?src-supplier=Avnet; Working Voltage: 200V; Height - Seated (Max): 0.024inch
R3 = ERJ-1TYJ104U: RES SMD 100K OHM 5% 1W 2512; Manufacturer: Panasonic; Component: 12; Resistance: 100kR; Temperature Coefficient: 200ppm/°C; Voltage Rating: 200V; Voltage Rating (DC): 250V; Manufacturer Part Number: ERJ-1TYJ104U; Supplier 1: Digi-Key; Supplier Part Number 1: PT100KXCT-ND; RoHS: Yes; Category: Chip SMD Resistors; Stock 1: 14258; Pricing 1: 1=0,39000, 10=0,30100, 100=0,12660, 1000=0,06987 (USD); Mount: Surface Mount; Case/Package: 2512; Case Code (Imperial): 2512; Case Code (Metric): 6432; Contact Plating: Tin; Min Operating Temperature: -55°C; Max Operating Temperature: 155°C; Tolerance: 5%; Packaging: Tape and Reel; Composition: Thick Film; Max Power Dissipation: 1W; Number of Terminations: 2; Power Rating: 1W; Package Quantity: 1; Military Standard: Not; Length: 6.4mm; Height: 0.028inch; Width: 0.126inch; Depth: 3.2mm; Radiation Hardening: No; Lead Free: Lead Free; REACH SVHC: No SVHC; ComponentLink1URL: https://datasheet.ciiva.com/34303/2010000-34303803.pdf?src-supplier=Jameco; ComponentLink1Description: https://datasheet.ciiva.com/34303/2010000-34303803.pdf?src-supplier=Jameco; ComponentLink2URL: https://datasheet.ciiva.com/43469/1678796-43469942.pdf?src-supplier=Farnell; ComponentLink2Description: https://datasheet.ciiva.com/43469/1678796-43469942.pdf?src-supplier=Farnell; ComponentLink3URL: https://datasheet.ciiva.com/7830/1678796-7830968.pdf?src-supplier=Element14; ComponentLink3Description: https://datasheet.ciiva.com/7830/1678796-7830968.pdf?src-supplier=Element14; ComponentLink4URL: https://datasheet.ciiva.com/46380/1678796-46380426.pdf?src-supplier=Element14; ComponentLink4Description: https://datasheet.ciiva.com/46380/1678796-46380426.pdf?src-supplier=Element14; ComponentLink5URL: https://datasheet.ciiva.com/30120/4aoa0000ce1-30120107.pdf?src-supplier=Onlinecomponents.com; ComponentLink5Description: https://datasheet.ciiva.com/30120/4aoa0000ce1-30120107.pdf?src-supplier=Onlinecomponents.com; ComponentLink6URL: https://datasheet.ciiva.com/17208/aoa0000ce1-17208142.pdf?src-supplier=Avnet+Europe; ComponentLink6Description: https://datasheet.ciiva.com/17208/aoa0000ce1-17208142.pdf?src-supplier=Avnet+Europe
R6 = B72220Q0321K101: EPCOS         B72220Q0321K101             TVS Varistor, B722 Series, 320 V, 420 V, 840 V, Disc 20mm, Metal Oxide Varistor (MOV); Manufacturer: TDK EPCOS; Component: 13; Tolerance: 10%; Voltage Rating (DC): 420V; Energy: 255J; Varistor Voltage: 510V; Max Voltage Rating (AC): 320V; Clamping Voltage: 840V; Clamping Current: 130A; Lead/Base Style: Radial; Capacitance: 780pF; Max Surge Current: 15kA; Lead Length: 30mm; Manufacturer Part Number: B72220Q0321K101; Supplier 1: Digi-Key; Supplier Part Number 1: 495-6475-ND; RoHS: Yes; Category: Resistors; Stock 1: 1450; Pricing 1: 1=1,61000, 10=1,42400, 25=1,28640, 100=1,12550, 250=0,98772, 500=0,87286, 1000=0,68910, 2500=0,64316, 5000=0,61100 (USD); Mount: Radial,Through Hole; Case/Package: Metal; Weight: 0.17637oz; Contact Plating: Tin; Min Operating Temperature: -40°C; Max Operating Temperature: 85°C; Packaging: Bulk; Package Quantity: 250; Length: 22.5mm; Depth: 6.3mm; REACH SVHC: No SVHC; ComponentLink1URL: https://datasheet.ciiva.com/1278/31623-1278144.pdf?src-supplier=Element14; ComponentLink1Description: https://datasheet.ciiva.com/1278/31623-1278144.pdf?src-supplier=Element14; ComponentLink2URL: https://datasheet.ciiva.com/15155/getdatasheetpartid-382578-15155932.pdf?src-supplier=Verical; ComponentLink2Description: https://datasheet.ciiva.com/15155/getdatasheetpartid-382578-15155932.pdf?src-supplier=Verical; Max Voltage Rating (DC): 420V; Voltage Tolerance: 10%; Voltage Rating (AC): 320V; Diameter: 20mm; Lead Pitch: 10mm; Thickness: 6.3mm